# Altium schematic sheet 3_Sterowanie kluczem.SchDoc
size A4
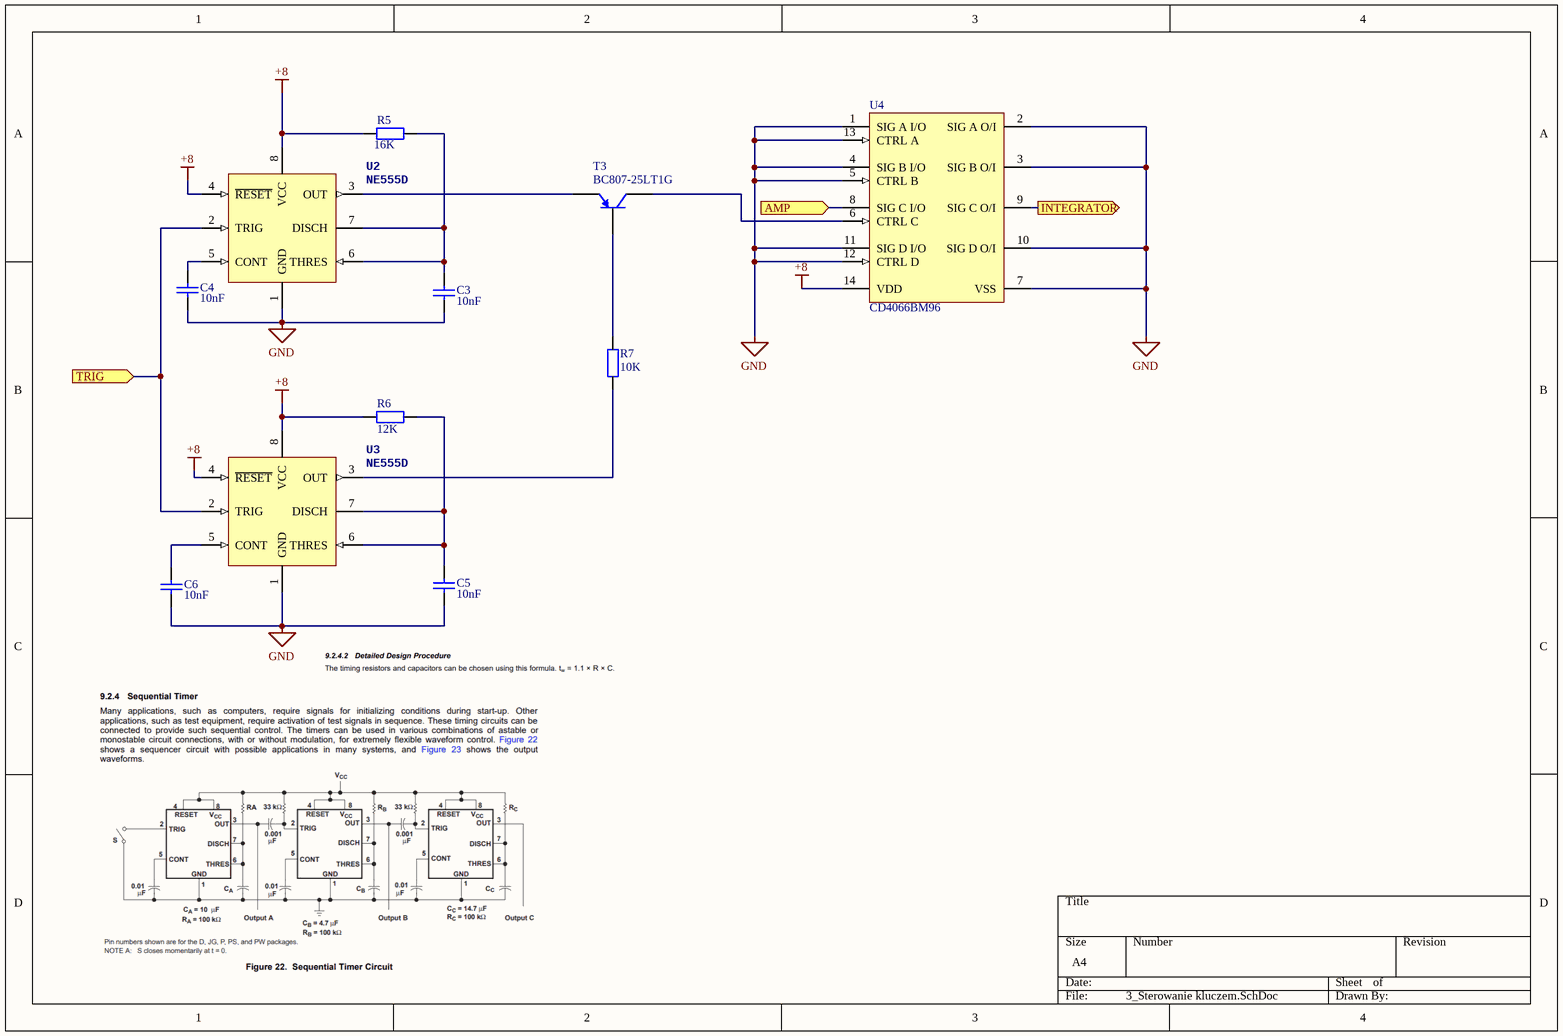
[diagram p0: 3_Sterowanie kluczem.SchDoc]

## Parts
C3  Capacitance: 10nF  [CAPC1608X92X38NL15T08]  (hidden comment: VJ0603Y103KNAAO)
C4  Capacitance: 10nF  [CAPC1608X92X38NL15T08]  (hidden comment: VJ0603Y103KNAAO)
C5  Capacitance: 10nF  [CAPC1608X92X38NL15T08]  (hidden comment: VJ0603Y103KNAAO)
C6  Capacitance: 10nF  [CAPC1608X92X38NL15T08]  (hidden comment: VJ0603Y103KNAAO)
R5  value 16K  [R1206]  (hidden comment: 1206S4J0163T5E@TME)
R6  value 12K  [R1206]  (hidden comment: 1206S4J0123T5E@TME)
R7  value 10K  [R1206]  (hidden comment: Resistor)
T3  BC807-25LT1G  [ONSC-SOT-23-3-318-08_V]
U2  NE555D  [D0008A_N]
U3  NE555D  [D0008A_N]
U4  CD4066BM96  [D0014A_M]

## Ports
AMP (in), INTEGRATOR (out), TRIG (in)

## Nets
+8: R5.1 R6.1 U2.4(~{RESET}) U2.8(VCC) U3.4(~{RESET}) U3.8(VCC) U4.14(VDD)
GND: C3.1 C4.1 C5.1 C6.1 U2.1(GND) U3.1(GND) U4.1(SIG_A_I/O) U4.2(SIG_A_O/I) U4.3(SIG_B_O/I) U4.4(SIG_B_I/O) U4.5(CTRL_B) U4.7(VSS) U4.10(SIG_D_O/I) U4.11(SIG_D_I/O) U4.12(CTRL_D) U4.13(CTRL_A)
AMP: U4.8(SIG_C_I/O) ; port AMP
INTEGRATOR: U4.9(SIG_C_O/I) ; port INTEGRATOR
TRIG: U2.2(TRIG) U3.2(TRIG) ; port TRIG
NetC3_2: C3.2 R5.2 U2.6(THRES) U2.7(DISCH)
NetC4_2: C4.2 U2.5(CONT)
NetC5_2: C5.2 R6.2 U3.6(THRES) U3.7(DISCH)
NetC6_2: C6.2 U3.5(CONT)
NetR7_1: R7.1 U3.3(OUT)
NetR7_2: R7.2 T3.1(B)
NetT3_2: T3.2(E) U2.3(OUT)
NetT3_3: T3.3(C) U4.6(CTRL_C)

## Library data of the parts
C3-C6 = CMP-2006-01968-1: Manufacturer: Vitramon; Part Number: VJ0603Y103KNAAO
R5 R6 = Res2: Resistor; Published: 8-Jun-2000; LatestRevisionDate: 17-Jul-2002; LatestRevisionNote: Re-released for DXP Platform.; PackageReference: AXIAL-0.4; Publisher: Altium Limited; PackageDescription: Axial Device, Thru-Hole; 2 Leads; 0.4 in Pin Spacing
R7 = Res
T3 = CMP-1048-00691-1: General Purpose Transistor, PNP Silicon, 3-Pin SOT-23, Pb-Free, Tape and Reel; Manufacturer: On Semiconductor; IC Continuous (A): -0.5; fT Min (MHz): 100; PackageDescription: 3-Pin Small Outline Transistor, Body 2.92 x 1.3 mm, Pitch 0.95 mm; Polarity: PNP; ComponentLink2URL: http://www.onsemi.com/pub_link/Collateral/BC807-16LT1-D.PDF; PackageReference: SOT-23-3-318-08; ComponentLink2Description: Datasheet; ComponentLink1Description: Manufacturer URL; PartNumber: BC807-25LT1G; ComponentLink3URL: http://www.onsemi.cn/pub_link/Collateral/318-08.PDF; Packing: Tape and Reel; DatasheetVersion: Rev. 10; RoHS: TRUE; ComponentLink3Description: Package Specification; PackageVersion: Rev. AP, 11/2009; ComponentLink1URL: http://www.onsemi.com/; Mounting Technology: Surface Mount
U2 U3 = CMP-2000-06840-1: Precision Timer, 4.5 to 16 V, 0 to 70 degC, 8-Pin SOIC (D), Green (RoHS & no Sb/Br), Tube; PartNumber: NE555; Manufacturer: Texas Instruments; Base Number: 555; No. of Timers: 1; Supply Voltage Min: 4.5V; Operating Frequency Max: 0.5MHz; Supply Voltage Range: 4.5Vto16V; No. of Pins: 8; Supply Voltage Max: 16V; IC Temperature Range: Commercial; SVHC: NoSVHC(19-Dec-2012); Operating Mode: Astable,Monostable; Frequency: 500kHz; Package Description: 8-Pin Small Outline Integrated Circuit, Body 4.9 x 3.9 mm, Pitch 1.27 mm; Datasheet URL: http://www.ti.com/general/docs/lit/getliterature.tsp?genericPartNumber=NE555&fileType=pdf; Mounting Technology: SurfaceMount; Operating Temperature Range: 0°Cto+70°C; Operating Temperature Min: 0°C; Package URL: http://www.ti.com/lit/ml/msoi002j/msoi002j.pdf; Datasheet Version: Rev. I, 09/2014; Manufacturer URL: http://www.ti.com/; Digital IC Case Style: SOIC; Clock External Input: No; Logic Function Number: 555; IC Generic Number: 555; No. of Channels: 1; Operating Temperature Max: 70°C; Package / Case: SOIC; Package Reference: D8; Device Marking: NE555D
U4 = CMP-1574-00003-3: CMOS Quad Bilateral Switch, D0014A, LARGE T&R; Manufacturer: Texas Instruments; Configuration: 4 X SPST (NO); Crosstalk: Yes; Ron(Max)(Ohms): 240; ICC(Typ)(mA): 0.00002; VCC(Min)(V): 3; Rating: Military; Ron(Typ)(Ohms): 125; Bandwidth(Max)(MHz): 40; VCC(Max)(V): 18; Operating Temperature Range(C): -55 to 125; Code_JEDEC: MS-012; DatasheetVersion: SCHS051D; PackageReference: D0014A; Output Type: CMOS; Generic Part Number: CD4066B; PackageVersion: http://www.ti.com/lit/ml/mpds177g/mpds177g.pdf